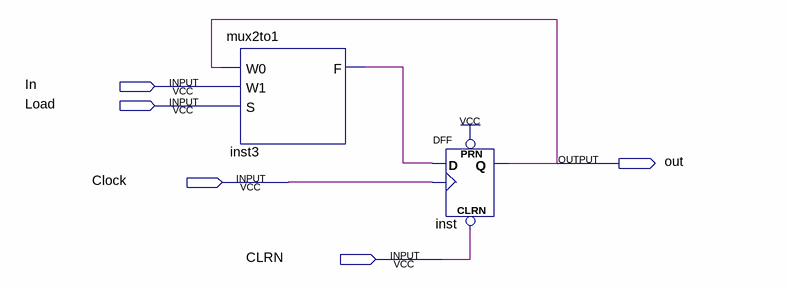
[diagram p0: schematic sheet]
// Quartus schematic register.bdf as structural Verilog: 2 symbols, 5 pins
module register (
  input  In,
  input  Load,
  input  Clock,
  input  CLRN,
  output out
);

  wire inst3_f;

  mux2to1 inst3 (.W0(out), .W1(In), .S(Load), .F(inst3_f));
  DFF inst (.CLRN(CLRN), .CLK(Clock), .D(inst3_f), .PRN(1'b1), .Q(out));
endmodule
